# Altium project AD_info.PrjPcb (part 1 of 2)
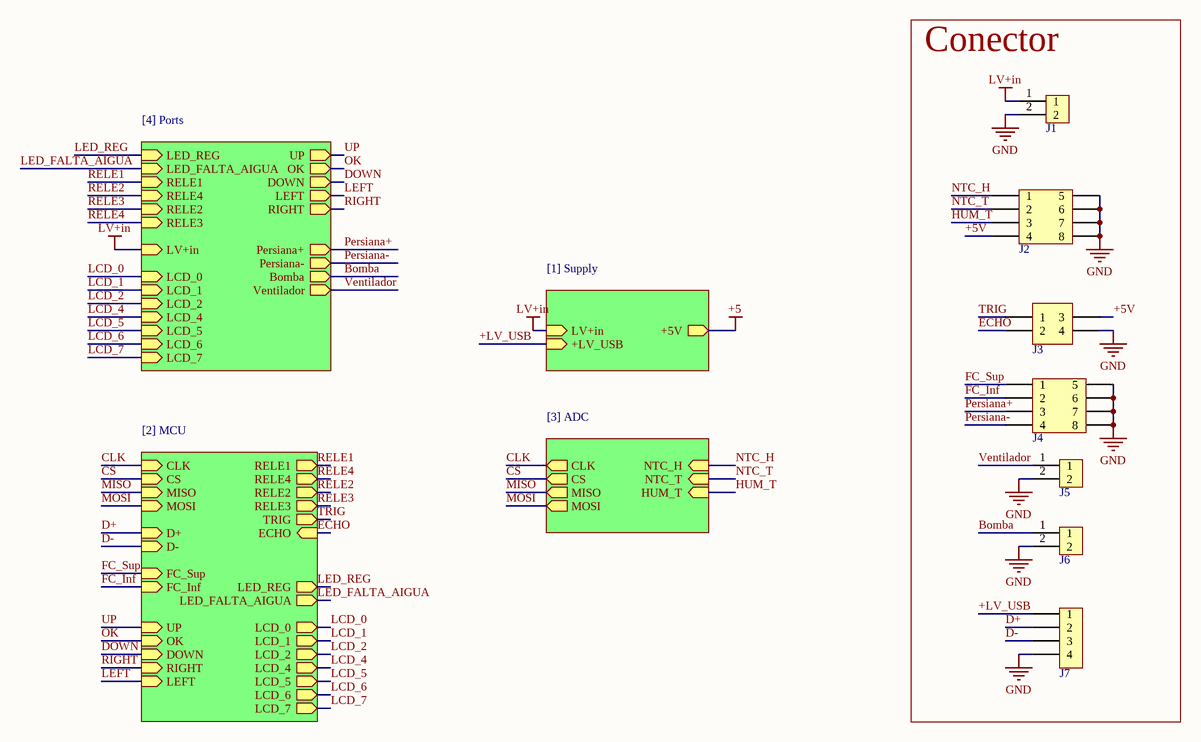
[diagram p0: AD_info.SchDoc]
AUTHORS: Bernat Canota, Yosra Azzouz, Carmen Unió, Inass Himiche; Company: UPC EEBE; Project: AD
5 sheets, 76 parts. Net scope: hierarchical (ports join the sheet entries above them; power ports are global).
Board file: AD_info.PcbDoc
Sheets:
  AD_info.SchDoc
    [1] Supply = [1] Supply.SchDoc
    [2] MCU = [2] MCU.SchDoc
    [3] ADC = [3] ADC.SchDoc
    [4] Ports = [4] Ports.SchDoc

## Sheet AD_info.SchDoc
size A4; DocumentNumber: 1; SheetNumber: 1; SheetTotal: 4

### Parts
J1  436500215  [J_MicroFit_2x1]  (value not drawn)
J2  105314-1108  [J_NanoFit_2X4]  (value not drawn)
J3  J_NanoFit_2x2  [J_NanoFit_2x2_v]  (value not drawn)
J4  105314-1108  [J_NanoFit_2X4]  (value not drawn)
J5  436500215  [J_MicroFit_2x1]  (value not drawn)
J6  436500215  [J_MicroFit_2x1]  (value not drawn)
J7  61300411121  [J_PinHeader_1x4]  (value not drawn)

### Blocks framed on the sheet
Conector: J1-J7

### Sub-sheets
[1] Supply = [1] Supply: LV+in (in), +5V (out), +LV_USB (in)
[2] MCU = [2] MCU: CLK (in), CS (in), MISO (in), MOSI (in), D+ (in), D- (in), TRIG (out), ECHO (in), FC_Sup (in), FC_Inf (in), RELE1 (out), RELE4 (out), RELE2 (out), RELE3 (out), UP (in), OK (in), DOWN (in), LEFT (in), RIGHT (in), LED_REG (out), LED_FALTA_AIGUA (out), LCD_0 (out), LCD_1 (out), LCD_2 (out), LCD_4 (out), LCD_5 (out), LCD_6 (out), LCD_7 (out)
[3] ADC = [3] ADC: CLK (out), CS (out), MISO (out), MOSI (out), NTC_H (in), NTC_T (in), HUM_T (in)
[4] Ports = [4] Ports: UP (out), OK (out), DOWN (out), LEFT (out), RIGHT (out), LED_REG (in), LED_FALTA_AIGUA (in), RELE1 (in), RELE4 (in), RELE2 (in), RELE3 (in), Persiana+ (out), Bomba (out), Persiana- (out), Ventilador (out), LV+in (in), LCD_0 (in), LCD_1 (in), LCD_2 (in), LCD_4 (in), LCD_5 (in), LCD_6 (in), LCD_7 (in)

### Nets
GND: J1.2 J2.5 J2.6 J2.7 J2.8 J3.4 J4.5 J4.6 J4.7 J4.8 J5.2 J6.2 J7.4
LV+in: J1.1 ; sheet [1] Supply/LV+in, sheet [4] Ports/LV+in
+5V: J2.4 J3.3
+LV_USB: J7.1 ; sheet [1] Supply/+LV_USB
Bomba: J6.1 ; sheet [4] Ports/Bomba
CLK: sheet [2] MCU/CLK, sheet [3] ADC/CLK
CS: sheet [2] MCU/CS, sheet [3] ADC/CS
D+: J7.2 ; sheet [2] MCU/D+
D-: J7.3 ; sheet [2] MCU/D-
DOWN: sheet [2] MCU/DOWN, sheet [4] Ports/DOWN
ECHO: J3.2 ; sheet [2] MCU/ECHO
FC_Inf: J4.2 ; sheet [2] MCU/FC_Inf
FC_Sup: J4.1 ; sheet [2] MCU/FC_Sup
HUM_T: J2.3 ; sheet [3] ADC/HUM_T
LCD_0: sheet [2] MCU/LCD_0, sheet [4] Ports/LCD_0
LCD_1: sheet [2] MCU/LCD_1, sheet [4] Ports/LCD_1
LCD_2: sheet [2] MCU/LCD_2, sheet [4] Ports/LCD_2
LCD_4: sheet [2] MCU/LCD_4, sheet [4] Ports/LCD_4
LCD_5: sheet [2] MCU/LCD_5, sheet [4] Ports/LCD_5
LCD_6: sheet [2] MCU/LCD_6, sheet [4] Ports/LCD_6
LCD_7: sheet [2] MCU/LCD_7, sheet [4] Ports/LCD_7
LED_FALTA_AIGUA: sheet [2] MCU/LED_FALTA_AIGUA, sheet [4] Ports/LED_FALTA_AIGUA
LED_REG: sheet [2] MCU/LED_REG, sheet [4] Ports/LED_REG
LEFT: sheet [2] MCU/LEFT, sheet [4] Ports/LEFT
MISO: sheet [2] MCU/MISO, sheet [3] ADC/MISO
MOSI: sheet [2] MCU/MOSI, sheet [3] ADC/MOSI
NTC_H: J2.1 ; sheet [3] ADC/NTC_H
NTC_T: J2.2 ; sheet [3] ADC/NTC_T
OK: sheet [2] MCU/OK, sheet [4] Ports/OK
Persiana+: J4.3 ; sheet [4] Ports/Persiana+
Persiana-: J4.4 ; sheet [4] Ports/Persiana-
RELE1: sheet [2] MCU/RELE1, sheet [4] Ports/RELE1
RELE2: sheet [2] MCU/RELE2, sheet [4] Ports/RELE4
RELE3: sheet [2] MCU/RELE3, sheet [4] Ports/RELE2  [project net RELE2]
RELE4: sheet [2] MCU/RELE4, sheet [4] Ports/RELE3  [project net RELE3]
RIGHT: sheet [2] MCU/RIGHT, sheet [4] Ports/RIGHT
TRIG: J3.1 ; sheet [2] MCU/TRIG
UP: sheet [2] MCU/UP, sheet [4] Ports/UP
Ventilador: J5.1 ; sheet [4] Ports/Ventilador

### Library data of the parts
J1 J5 J6 = J_MicroFit_2x1: Header 1 Row Vertical Polarizing Peg 2 Pin SMT/Glow Wire Compatible Tin Plate; Manufacturer 1: Molex; Manufacturer Part Number 1: 43650-0215; Supplier 1: Arrow Electronics; RoHS: Yes; Category: Headers and Wire Housings; Stock 1: 11086; Pricing 1: 1=0,87800, 10=0,74400, 80=0,63070, 3264=0,47000, 6528=0,45100, 13056=0,41760 (USD); ComponentLink1URL: https://datasheet.ciiva.com/19462/884109-19462034.pdf?src-supplier=Jameco; ComponentLink1Description: https://datasheet.ciiva.com/19462/884109-19462034.pdf?src-supplier=Jameco; ComponentLink2URL: https://datasheet.ciiva.com/5157/0436500215-pcb-headers-148687-5157608.pdf?src-supplier=Mouser; ComponentLink2Description: https://datasheet.ciiva.com/5157/0436500215-pcb-headers-148687-5157608.pdf?src-supplier=Mouser; ComponentLink3URL: https://datasheet.ciiva.com/16085/0436500215-pcb-headers-16085668.pdf?src-supplier=Onlinecomponents.com; ComponentLink3Description: https://datasheet.ciiva.com/16085/0436500215-pcb-headers-16085668.pdf?src-supplier=Onlinecomponents.com; ComponentLink4URL: https://datasheet.ciiva.com/11748/0900766b80307ce2-11748388.pdf?src-supplier=RSComponents; ComponentLink4Description: https://datasheet.ciiva.com/11748/0900766b80307ce2-11748388.pdf?src-supplier=RSComponents; ComponentLink5URL: https://datasheet.ciiva.com/9432/0436500215-pcb-headers-9432850.pdf?src-supplier=Avnet; ComponentLink5Description: https://datasheet.ciiva.com/9432/0436500215-pcb-headers-9432850.pdf?src-supplier=Avnet; ComponentLink6URL: https://datasheet.ciiva.com/7920/1889390-7920892.pdf?src-supplier=Element14; ComponentLink6Description: https://datasheet.ciiva.com/7920/1889390-7920892.pdf?src-supplier=Element14; Supplier Part Number 1: 43650-0215
J2 J4 = J_NanoFit_2x4: Nano-Fit Right Angle Header Through Hole 2.50mm Pitch Dual Row 8 Circuits Tin (Sn) Plating Black; Manufacturer: Molex; Temperature rating: -40° to +105°C; Category type: PCB header; Maximum current: 7.5 A; Maximum voltage: 750 V AC; Connections: 2x4; Connector Type: Header,Male Pin; Number of Positions: 8; .Creator: DO; Category: Connector; ComponentLink1Description: Datasheet; ComponentLink1URL: https://www.molex.com/molex/products/part-detail/pcb_headers/1053141104; ComponentLink2Description: Where buy it; ComponentLink2URL: *; Manufacturer part number: 105314-1108; Supplier: *; RoHS: *; Application: Wire to board; Product name: Nano-Fit; Flammability: 94V-0; Orientation: Right Angle; Mount: Through hole; Supplier 1: Digi-Key; Stock 1: 11021; Pricing 1: 1=1,98000, 10=1,68600, 156=1,39308, 1092=1,09983, 4992=0,97518, 10140=0,95318 (USD); Contact Plating: Tin; Contact Material: Brass; Contact Shape: Square; Insulation Material: Polymer; Insulation Color: Black; Min Operating Temperature: -40°C; Max Operating Temperature: 105°C; Fastening Type: Latch; Packaging: Tray; Number of Rows: 2; Termination: Solder; RoHS Compliant: Yes; ComponentLink3URL: http://www.farnell.com/datasheets/2551096.pdf?src-supplier=Newark; ComponentLink3Description: http://www.farnell.com/datasheets/2551096.pdf?src-supplier=Newark; ComponentLink4URL: https://www.molex.com/pdm_docs/sd/1053141104_sd.pdf?src-supplier=Digi-Key; ComponentLink4Description: https://www.molex.com/pdm_docs/sd/1053141104_sd.pdf?src-supplier=Digi-Key; Supplier Part Number 1: WM16909-ND
J3 = J_NanoFit_2x2: Conn Nano-Fit Power HDR 4 POS 2.5mm Solder ST Through Hole 4 Terminal Single Port Tray; Manufacturer 1: Molex; Manufacturer Part Number 1: 1053101104; Supplier 1: Farnell; RoHS: Yes; Category: Uncategorized; Stock 1: 255; Pricing 1: 1=1,43000, 10=1,18000, 50=0,74900, 100=0,72900, 500=0,71400, 1000=0,70700 (EUR); ComponentLink1URL: https://www.molex.com/pdm_docs/ps/PS-105300-100-001.pdf?src-supplier=Digi-Key; ComponentLink1Description: https://www.molex.com/pdm_docs/ps/PS-105300-100-001.pdf?src-supplier=Digi-Key; Supplier Part Number 1: 2820681
J7 = J_UART: CONN HEADER 4 POS 2.54; Manufacturer 1: Wurth Electronics; Number of Positions: 4; Gender: Male; Connector Type: Male Pin; Pitch: 0.1inch; .Creator: AC; Supplier 1: RSComponents; Manufacturer Part Number 1: 61300411121; RoHS: Yes; Category: Headers and Wire Housings; Stock 1: 1; Pricing 1: 5=0,19500, 250=0,08000, 500=0,07700, 2500=0,07500, 5000=0,07200 (USD); Mount: Through Hole; Contact Plating: Gold; Contact Material: Copper; Color: Black; Number of Rows: 1; Packaging: Bulk; Termination: Solder; Number of Contacts: 4; Contact Mating Length: 0.236inch; REACH SVHC: Unknown; Lead Free: Lead Free; RoHS Compliant: Yes; ComponentLink1URL: http://www.farnell.com/cad/1737268.pdf?src-supplier=Element14; ComponentLink1Description: http://www.farnell.com/cad/1737268.pdf?src-supplier=Element14; ComponentLink2URL: https://katalog.we-online.de/em/datasheet/6130xx11121.pdf?src-supplier=Digi-Key; ComponentLink2Description: https://katalog.we-online.de/em/datasheet/6130xx11121.pdf?src-supplier=Digi-Key; Supplier Part Number 1: 8281594

## Sheet [1] Supply.SchDoc
size A4; DocumentNumber: 2; SheetNumber: 2; SheetTotal: 4
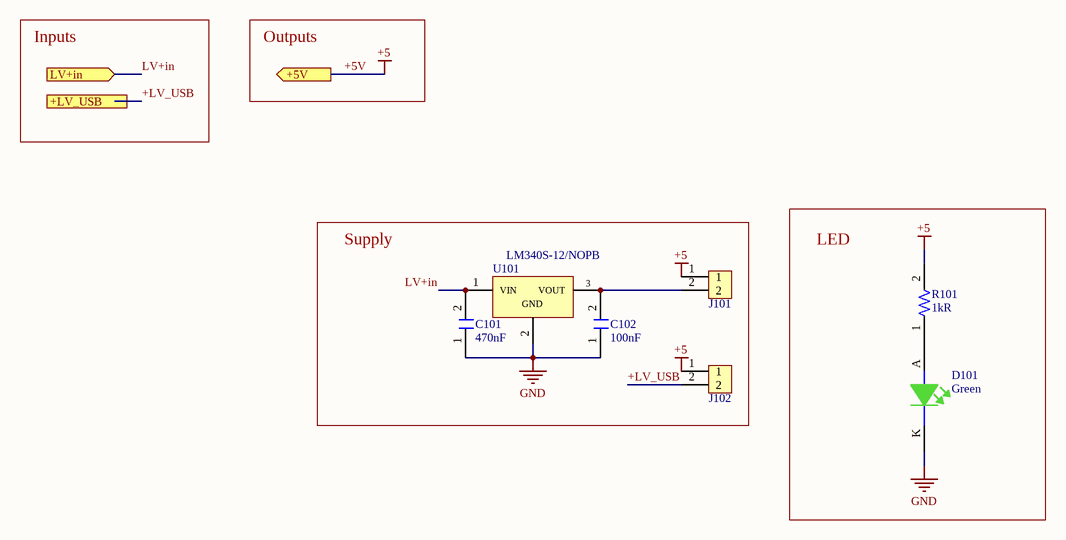
[diagram p1: [1] Supply.SchDoc]

### Parts
C101  Capacitance: 470nF  [C1206FNPC-RW]  (hidden comment: 885012208011)
C102  Capacitance: 100nF  [C1206FNPC-RW]  (hidden comment: 885012208058)
D101  Color: Green  [LED_1206_WE]  (hidden comment: 150120GS75000)
J101  61300211121  [J_Pinheader_1x2]  (value not drawn)
J102  61300211121  [J_Pinheader_1x2]  (value not drawn)
R101  Resistance: 1kR  [R1206FTK-W]  (hidden comment: ERJT08J102V)
U101  Manufacturer Part Number: LM340S-12/NOPB  [LDO_35V-1/12V-TO220]  (hidden comment: DO_35V-1/12V-TO220)

### Blocks framed on the sheet
Supply: C101 C102 J101 J102 U101
LED: D101 R101

### Ports
+5V (out, see AD_info[3B]), +LV_USB (in, see AD_info[3B]), LV+in (in, see AD_info[3B])

### Nets
+5V: J101.1 J102.1 R101.2 ; port +5V  [also labelled +5]
GND: C101.1 C102.1 D101.K U101.2(GND)
LV+in: C101.2 U101.1(VIN) ; port LV+in
+LV_USB: J102.2 ; port +LV_USB
NetC102_2: C102.2 J101.2 U101.3(VOUT)
NetD101_A: D101.A R101.1

### Notes on the sheet
- Inputs
- Outputs

### Library data of the parts
C101 = C470n-10V-1206FNPC-X7R: Cap, 0.47ΜF, 10V, 10%, X7R, 1206; Manufacturer 1: Wurth Electronics; .Creator: DO; Supplier 1: Digi-Key; Manufacturer Part Number 1: 885012208011; RoHS: Yes; Category: Ceramic Capacitors; Stock 1: 1142; Pricing 1: 1=0,20000, 10=0,17700, 100=0,15900, 500=0,14000 (USD); Mount: Surface Mount; Case/Package: 1206; Case Code (Metric): 3216; Case Code (Imperial): 1206; Min Operating Temperature: -55°C; Max Operating Temperature: 125°C; Packaging: Tape and Reel; Voltage Rating: 10V; Tolerance: 10%; Length: 0.126inch; Width: 0.063inch; Thickness: 0.051inch; RoHS Compliant: Yes; ComponentLink1URL: http://www.farnell.com/datasheets/2546926.pdf?src-supplier=Farnell; ComponentLink1Description: http://www.farnell.com/datasheets/2546926.pdf?src-supplier=Farnell; ComponentLink2URL: https://katalog.we-online.de/pbs/datasheet/885012208011.pdf?src-supplier=Digi-Key; ComponentLink2Description: https://katalog.we-online.de/pbs/datasheet/885012208011.pdf?src-supplier=Digi-Key; Supplier Part Number 1: 732-7683-1-ND; ComponentLink3Description: Wurth Elektronik; ComponentLink3URL: https://www.we-online.com/catalog/en/WCAP-CSGP-10VDC?sq=885012208011#885012208011
C102 = C100n-25V-1206FNPC-X7R: Cap Cer 0.1UF 25V X7R 1206; Manufacturer: Wurth Electronics; Tolerance: 10%; .Creator: DO; Category: Capacitor; ComponentLink1Description: Datasheet; ComponentLink1URL: https://www.we-online.com/catalog/datasheet/885012208058.pdf; ComponentLink2Description: Where buy it; ComponentLink2URL: https://www.we-online.com/catalog/en/WCAP-CSGP-25VDC#885012208058; Supplier 1: Digi-Key; Manufacturer Part Number: 885012208058; RoHS: Yes; Stock 1: 4375; Pricing 1: 1=0,11000, 10=0,10100, 100=0,09100, 500=0,08000 (USD); Mount: Surface Mount; Case/Package: 1206; Case Code (Metric): 3216; Case Code (Imperial): 1206; Min Operating Temperature: -55°C; Max Operating Temperature: 125°C; Packaging: Tape and Reel; Voltage Rating: 25V; Length: 0.126inch; Width: 0.063inch; Thickness: 0.035inch; RoHS Compliant: Yes; ComponentLink3URL: https://katalog.we-online.de/pbs/datasheet/885012208058.pdf?src-supplier=Digi-Key; ComponentLink3Description: https://katalog.we-online.de/pbs/datasheet/885012208058.pdf?src-supplier=Digi-Key; Supplier Part Number 1: 732-8109-1-ND
D101 = LEDGS-1206-450: Led, Green, 520 Nm, 3.2 V, 30 Ma, 450 Mcd Rohs Compliant: Yes; Manufacturer: Wurth Electronics; Wavelength: 520nm; Luminous Intensity: 450mcd; Viewing Angle: 140°; Forward Current: 30mA; Lens Style: Clear,Rectangular; Test Current: 20mA; Forward Voltage: 3.2V; .Creator: GP; Supplier 1: RSComponents; RoHS: Yes; Category: LEDs; Stock 1: 1; Pricing 1: 50=0,23200, 500=0,16400, 750=0,15500, 1500=0,15000, 3000=0,14200 (USD); Mount: Surface Mount; Case/Package: 1206; Case Code (Metric): 3216; Case Code (Imperial): 1206; Min Operating Temperature: -40°C; Max Operating Temperature: 85°C; Package Quantity: 3000; Packaging: Tape and Reel; Dominant Wavelength: 520nm; Length: 3.2mm; Width: 1.6mm; Height: 0.68mm; REACH SVHC: Unknown; RoHS Compliant: Yes; ComponentLink1URL: https://datasheet.ciiva.com/22656/150120gs75000-22656979.pdf?src-supplier=Element14; ComponentLink1Description: https://datasheet.ciiva.com/22656/150120gs75000-22656979.pdf?src-supplier=Element14; ComponentLink2URL: https://datasheet.ciiva.com/29279/759441-da-01-en-chipled-1206-w-kl-gruen-150120gs75000-29279042.pdf?src-supplier=Conrad; ComponentLink2Description: https://datasheet.ciiva.com/29279/759441-da-01-en-chipled-1206-w-kl-gruen-150120gs75000-29279042.pdf?src-supplier=Conrad; ComponentLink3URL: https://datasheet.ciiva.com/48430/150120gs75000-eng-tds-48430053.pdf?src-supplier=Distrelec; ComponentLink3Description: https://datasheet.ciiva.com/48430/150120gs75000-eng-tds-48430053.pdf?src-supplier=Distrelec; ComponentLink4URL: https://datasheet.ciiva.com/29561/150120gs75000-29561883.pdf?src-supplier=Digi-Key; ComponentLink4Description: https://datasheet.ciiva.com/29561/150120gs75000-29561883.pdf?src-supplier=Digi-Key; ComponentLink5URL: https://datasheet.ciiva.com/29561/150120gs75000-29561884.pdf?src-supplier=Digi-Key; ComponentLink5Description: https://datasheet.ciiva.com/29561/150120gs75000-29561884.pdf?src-supplier=Digi-Key; ComponentLink6URL: https://datasheet.ciiva.com/29561/150120gs75000-29561885.pdf?src-supplier=Digi-Key; ComponentLink6Description: https://datasheet.ciiva.com/29561/150120gs75000-29561885.pdf?src-supplier=Digi-Key; Supplier Part Number 1: 8154247P; Manufacturer Part Number: 150120GS75000; ComponentLink7Description: Where buy it; ComponentLink7URL: https://www.we-online.com/catalog/en/WL-SMCW?sq=150120GS75000#150120GS75000
J101 J102 = J_Jumper: CONN HEADER 2 POS 2.54; Manufacturer: Molex; Temperature rating: -40° to +105°C; Category type: PCB-PCB; Product name: Pin Header; Maximum current: 3 A; Maximum voltage: 250 V AC; Connections: 1x2; Current Rating: 3A; Voltage Rating: 250V; Number of Positions: 2; Gender: Male; Connector Type: Male Pin; Pitch: 0.1inch; .Creator: GP; Category: Connector; ComponentLink1Description: Datasheet; ComponentLink1URL: https://www.we-online.com/catalog/datasheet/61300211121.pdf; ComponentLink2Description: Where buy it; ComponentLink2URL: https://www.we-online.com/catalog/en/PHD_2_54_THT_PIN_HEADER_6130XX11121?sq=61300211121&sp=https%3A%2F%2Fwww.we-online.com%2Fweb%2Fen%2Fwuerth_elektronik%2Fsearchpage.php%3Fsearch%3D61300211121#61300211121; Manufacturer part number: 61300211121; Supplier: Würth Elektronik; RoHS: *; Application: Shortcircuit; Flammability: 94V-0; Orientation: Vertical; Mount: Through hole; Supplier 1: RSComponents; Stock 1: 1855; Pricing 1: 5=0,14100, 50=0,09700, 100=0,07800, 200=0,07300, 500=0,06800 (USD); Contact Plating: Gold; Housing Material: PBT; Contact Material: Copper Alloy,Copper; Color: Black; Min Operating Temperature: -40°C; Max Operating Temperature: 125°C; Number of Rows: 1; Contact Gender: Male; Packaging: Bulk; Termination: Through Hole; Number of Contacts: 2; Contact Mating Length: 0.236inch; REACH SVHC: Unknown; Lead Free: Lead Free; ComponentLink3URL: https://datasheet.ciiva.com/13619/6130xx11121-48870-13619345.pdf?src-supplier=Mouser; ComponentLink3Description: https://datasheet.ciiva.com/13619/6130xx11121-48870-13619345.pdf?src-supplier=Mouser; Supplier Part Number 1: 8281581
R101 = R1k-1206FTK: Res Thick Film 1206 1K Ohm 5% 0.33W(1/3W) ±200ppm/C Pad SMD Automotive T/R; Manufacturer: Panasonic; Temperature Coefficient: 200ppm/°C; Power Rating: 330mW; Voltage Rating: 200V; Max Power Dissipation: 333mW; .Creator: GP; Category: Resistor; ComponentLink1Description: Datasheet; ComponentLink1URL: https://docs.rs-online.com/ef78/0900766b812cb812.pdf; ComponentLink2Description: Where buy it; ComponentLink2URL: https://es.rs-online.com/web/p/resistencias-de-montaje-en-superficie/7218936; Supplier 1: RSComponents; Manufacturer Part Number: ERJT08J102V; RoHS: Yes; Stock 1: 1; Pricing 1: 5=0,32200, 50=0,30000, 100=0,28100, 250=0,25900, 500=0,23800 (USD); Mount: Surface Mount; Case/Package: 1206; Number of Pins: 2; Contact Plating: Tin; Case Code (Metric): 3216; Case Code (Imperial): 1206; Min Operating Temperature: -55°C; Max Operating Temperature: 155°C; Tolerance: 5%; Resistor Type: Thick Film; Package Quantity: 5000; Packaging: Tape and Reel; Number of Terminations: 2; Voltage Rating (DC): 200V; Termination: Tab; Features: Automotive AEC-Q200; Length: 3.2mm; Width: 0.063inch; Height: 0.6mm; Depth: 1.6mm; Radiation Hardening: No; REACH SVHC: No SVHC; Military Standard: Not; RoHS Compliant: Yes; Supplier Part Number 1: 7218936
U101 = CMP-00147-1: 1.5-A, 35-V, linear voltage regulator 3-TO-220 -40 to 125; Manufacturer: Texas Instruments; Output Voltage: 12V; Quiescent Current: 8mA; Output Type: Fixed; Dropout Voltage: 2V; Accuracy: 2%; Output Current: 1A; .Creator: AC; Number of Outputs: 1; Polarity: Positive; Max Input Voltage: 35V; Mount: Through Hole; Package Quantity: 45; Width: 4.7mm; RoHS: Yes; ComponentLink1URL: https://datasheet.ciiva.com/16490/lm340-n-16490133.pdf?src-supplier=Avnet+Asia; Min Operating Temperature: -40°C; Number of Pins: 3; RoHS Compliant: Yes; ComponentLink2URL: https://es.rs-online.com/web/p/reguladores-de-tension/1977323; Max Operating Temperature: 125°C; Design Item ID: LDO_35V-1/12V-TO220; Source: Semiconductor.SchLib; ComponentLink2Description: Where buy it; Length: 10.16mm; Category: Voltage Regulators - Linear; Pricing 1: 1=1,97000, 10=1,76700, 25=1,66680, 100=1,42020, 250=1,33348, 500=1,16680, 1000=1,10075 (USD); Lead Free: Lead Free; ComponentLink1Description: https://datasheet.ciiva.com/16490/lm340-n-16490133.pdf?src-supplier=Avnet+Asia; Height: 8.89mm; Packaging: Rail/Tube; Radiation Hardening: No; Series: LM340-N; Max Output Current: 1A; Voltage: 12V; Case/Package: TO-220; Output Voltage Accuracy: 2%

## Sheet [2] MCU.SchDoc
size A4; DocumentNumber: 3; SheetNumber: 3; SheetTotal: 4
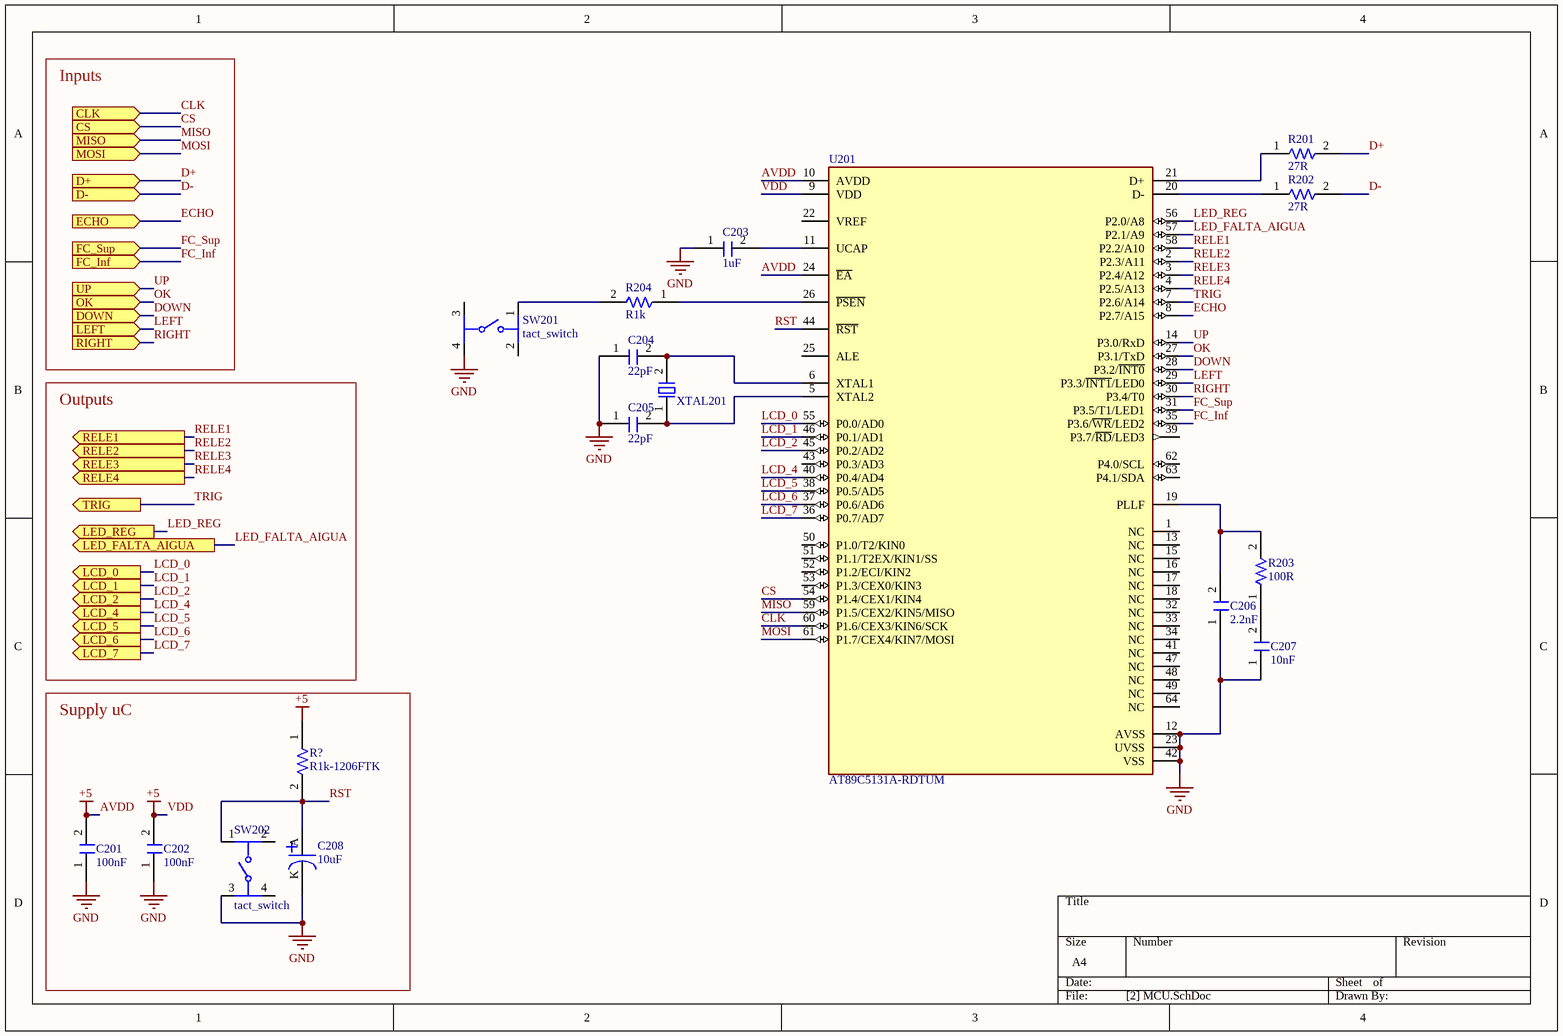
[diagram p2: [2] MCU.SchDoc]

### Parts
C201  Capacitance: 100nF  [C1206FNPC-RW]  (hidden comment: 885012208058)
C202  Capacitance: 100nF  [C1206FNPC-RW]  (hidden comment: 885012208058)
C203  Capacitance: 1uF  [C1206FNPC-RW]  (hidden comment: 885012208013)
C204  Capacitance: 22pF  [C0805FNPC-W]  (hidden comment: 885012208058)
C205  Capacitance: 22pF  [C0805FNPC-W]  (hidden comment: 885012208058)
C206  Capacitance: 2.2nF  [C2.2u-100V-1812MLCC-X7R]  (hidden comment: HMK432B7225KM-T)
C207  Capacitance: 10nF  [C0805FNPC-R]  (hidden comment: 885012207092)
C208  10uF  [C100u-100V-0.9A]
R201  Resistance: 27R  [R1206FTK-W]  (hidden comment: RCC1206470RFKEA)
R202  Resistance: 27R  [R1206FTK-W]  (hidden comment: RCC1206470RFKEA)
R203  Resistance: 100R  [R1206FTK-W]  (hidden comment: CRG1206F100R)
R204  R1k  [R1206FTK-W]
R?  R1k-1206FTK  [R1206FTK-W]
SW201  tact_switch  [FP-PTS647SK38SMTR2LFS-MFG]
SW202  tact_switch  [FP-PTS647SK38SMTR2LFS-MFG]
U201  AT89C5131A-RDTUM  [FP-AT89C5131A-RDTUM-IPC_C]
XTAL201  XTAL20M_SMD  [XTAL20M_SMD]  (value not drawn)

### Blocks framed on the sheet
Supply uC: C201 C202 C208 R? SW202

### Ports
CLK (in, see AD_info[2B], [3] ADC[1A]), CS (in, see AD_info[2B], [3] ADC[1A]), D+ (in, see AD_info[2B]), D- (in, see AD_info[2B]), DOWN (in, see AD_info[2C], [4] Ports[1B]), ECHO (in, see AD_info[2B]), FC_Inf (in, see AD_info[2B]), FC_Sup (in, see AD_info[2B]), LCD_0 (out, see AD_info[2B], [4] Ports[1A]), LCD_1 (out, see AD_info[2C], [4] Ports[1A]), LCD_2 (out, see AD_info[2C], [4] Ports[1B]), LCD_4 (out, see AD_info[2C], [4] Ports[1B]), LCD_5 (out, see AD_info[2C], [4] Ports[1B]), LCD_6 (out, see AD_info[2C], [4] Ports[1B]), LCD_7 (out, see AD_info[2C], [4] Ports[1B]), LED_FALTA_AIGUA (out, see AD_info[2B], [4] Ports[1A]), LED_REG (out, see AD_info[2B], [4] Ports[1A]), LEFT (in, see AD_info[2C], [4] Ports[1B]), MISO (in, see AD_info[2B], [3] ADC[1A]), MOSI (in, see AD_info[2B], [3] ADC[1B]), OK (in, see AD_info[2C], [4] Ports[1B]), RELE1 (out, see AD_info[2B], [4] Ports[1A]), RELE2 (out, see AD_info[2B]), RELE3 (out, see AD_info[2B]), RELE4 (out, see AD_info[2B]), RIGHT (in, see AD_info[2C], [4] Ports[1B]), TRIG (out, see AD_info[2B]), UP (in, see AD_info[2B], [4] Ports[1B])

### Nets
+5: C201.2 C202.2 R?.1 U201.9(VDD) U201.10(AVDD) U201.24(~{EA})  [also labelled AVDD, VDD]  [project net +5V]
GND: C201.1 C202.1 C203.1 C204.1 C205.1 C206.1 C207.1 C208.K(-) SW201.4 SW202.3 U201.12(AVSS) U201.23(UVSS) U201.42(VSS)
CLK: U201.60(P1.6/CEX3/KIN6/SCK) ; port CLK
CS: U201.54(P1.4/CEX1/KIN4) ; port CS
D+: R201.2 ; port D+
D-: R202.2 ; port D-
DOWN: U201.28(P3.2/~{INT0}) ; port DOWN
ECHO: U201.8(P2.7/A15) ; port ECHO
FC_Inf: U201.35(P3.6/~{WR}/LED2) ; port FC_Inf
FC_Sup: U201.31(P3.5/T1/LED1) ; port FC_Sup
LCD_0: U201.55(P0.0/AD0) ; port LCD_0
LCD_1: U201.46(P0.1/AD1) ; port LCD_1
LCD_2: U201.45(P0.2/AD2) ; port LCD_2
LCD_4: U201.40(P0.4/AD4) ; port LCD_4
LCD_5: U201.38(P0.5/AD5) ; port LCD_5
LCD_6: U201.37(P0.6/AD6) ; port LCD_6
LCD_7: U201.36(P0.7/AD7) ; port LCD_7
LED_FALTA_AIGUA: U201.57(P2.1/A9) ; port LED_FALTA_AIGUA
LED_REG: U201.56(P2.0/A8) ; port LED_REG
LEFT: U201.29(P3.3/~{INT1}/LED0) ; port LEFT
MISO: U201.59(P1.5/CEX2/KIN5/MISO) ; port MISO
MOSI: U201.61(P1.7/CEX4/KIN7/MOSI) ; port MOSI
OK: U201.27(P3.1/TxD) ; port OK
RELE1: U201.58(P2.2/A10) ; port RELE1
RELE2: U201.2(P2.3/A11) ; port RELE2
RELE3: U201.3(P2.4/A12) ; port RELE3  [project net RELE2]
RELE4: U201.4(P2.5/A13) ; port RELE4  [project net RELE3]
RIGHT: U201.30(P3.4/T0) ; port RIGHT
RST: C208.A(+) R?.2 SW202.1 U201.44(~{RST})
TRIG: U201.7(P2.6/A14) ; port TRIG
UP: U201.14(P3.0/RxD) ; port UP
NetC203_2: C203.2 U201.11(UCAP)
NetC204_2: C204.2 U201.6(XTAL1) XTAL201.2
NetC205_2: C205.2 U201.5(XTAL2) XTAL201.1
NetC206_2: C206.2 R203.2 U201.19(PLLF)
NetC207_2: C207.2 R203.1
NetR201_1: R201.1 U201.21(D+)
NetR202_1: R202.1 U201.20(D-)
NetR204_1: R204.1 U201.26(~{PSEN})
NetR204_2: R204.2 SW201.1

Not connected (* = marked no-connect by the designer): SW201 2 3; SW202 2 4; U201 1(NC) 13(NC) 15(NC) 16(NC) 17(NC) 18(NC) 22(VREF) 25(ALE) 32(NC) 33(NC) 34(NC) 39(P3.7/~{RD}/LED3) 41(NC) 43(P0.3/AD3) 47(NC) 48(NC) 49(NC) 50(P1.0/T2/KIN0) 51(P1.1/T2EX/KIN1/SS) 52(P1.2/ECI/KIN2) 53(P1.3/CEX0/KIN3) 62(P4.0/SCL) 63(P4.1/SDA) 64(NC)

### Notes on the sheet
- Inputs
- Outputs

### Library data of the parts
C201 C202 = C100n-25V-1206FNPC-X7R: as C102 on sheet [1] Supply; Category: Capacitor; ComponentLink1Description: Datasheet; ComponentLink1URL: https://www.we-online.com/catalog/datasheet/885012208058.pdf; ComponentLink2Description: Where buy it; ComponentLink2URL: https://www.we-online.com/catalog/en/WCAP-CSGP-25VDC#885012208058; Supplier 1: Digi-Key; Manufacturer Part Number: 885012208058; RoHS: Yes; Stock 1: 4375; Pricing 1: 1=0,11000, 10=0,10100, 100=0,09100, 500=0,08000 (USD); Mount: Surface Mount; Case/Package: 1206; Case Code (Metric): 3216; Case Code (Imperial): 1206; Min Operating Temperature: -55°C; Max Operating Temperature: 125°C; Packaging: Tape and Reel; Voltage Rating: 25V; Length: 0.126inch; Width: 0.063inch; Thickness: 0.035inch; RoHS Compliant: Yes; ComponentLink3URL: https://katalog.we-online.de/pbs/datasheet/885012208058.pdf?src-supplier=Digi-Key; ComponentLink3Description: https://katalog.we-online.de/pbs/datasheet/885012208058.pdf?src-supplier=Digi-Key; Supplier Part Number 1: 732-8109-1-ND
C203 = C1u-10V-1206FNPC-X7R: Cap, Mlcc, X7R, 1Uf, 10V, 1206 Rohs Compliant: Yes; Manufacturer 1: Wurth Electronics; Tolerance: 10%; .Creator: GP; Supplier 1: Digi-Key; Manufacturer Part Number 1: 885012208013; RoHS: Yes; Category: Ceramic Capacitors; Stock 1: 2734; Pricing 1: 1=0,16000, 10=0,14900, 100=0,13300, 500=0,11800 (USD); Mount: Surface Mount; Case/Package: 1206; Case Code (Metric): 3216; Case Code (Imperial): 1206; Min Operating Temperature: -55°C; Max Operating Temperature: 125°C; Packaging: Tape and Reel; Voltage Rating: 10V; Length: 0.126inch; Width: 0.063inch; Thickness: 0.051inch; RoHS Compliant: Yes; ComponentLink1URL: https://katalog.we-online.de/pbs/datasheet/885012208013.pdf?src-supplier=Digi-Key; ComponentLink1Description: https://katalog.we-online.de/pbs/datasheet/885012208013.pdf?src-supplier=Digi-Key; Supplier Part Number 1: 732-7685-1-ND; ComponentLink2Description: Wurth Elektronik; ComponentLink2URL: https://www.we-online.com/catalog/en/WCAP-CSGP-10VDC?sq=885012208013#885012208013
C204 C205 = C0.22u-0805FNPC-X5R: Cap Ceramic 0.22uF 50V X5R 10% Pad SMD 0805 85C Low ESR Automotive T/R; Manufacturer: Taiyo Yuden; Manufacturer Part Number: UMK212BJ224KGHT; .Creator: DR; Category: Capacitor; ComponentLink1Description: Datasheet; ComponentLink1URL: https://eu.mouser.com/datasheet/2/396/taiyo_yuden_12132018_mlcc11_hq_e-1510082.pdf; ComponentLink2Description: Where buy it; ComponentLink2URL: https://eu.mouser.com/ProductDetail/Taiyo-Yuden/UMK212BJ224KGHT?qs=CNQs48zzdnpf%2FbZJTfp33Q%3D%3D; Supplier 1: Digi-Key; RoHS: Yes; Stock 1: 900; Pricing 1: 1=0,20000, 10=0,13700, 50=0,08220, 100=0,06950, 500=0,04754, 1000=0,04206 (USD); Mount: Surface Mount; Case/Package: 0805; Case Code (Metric): 2012; Case Code (Imperial): 0805; Min Operating Temperature: -55°C; Max Operating Temperature: 85°C; Package Quantity: 3000; Packaging: Tape and Reel; Tolerance: 10%; Voltage Rating: 50V; Voltage Rating (DC): 50V; Dielectric: X5R; Termination: SMD/SMT; Length: 0.079inch; Width: 0.049inch; Height: 1.25mm; Thickness: 0.053inch; Ratings: AEC-Q200; Lead Free: Lead Free; Halogen Free: Halogen Free; RoHS Compliant: Yes; Supplier Part Number 1: 587-3514-1-ND
C206 = C2.2u-100V-1812MLCC-X7R: 贴片陶瓷电容 2.2uF ±10% 100V X7R 1812; Manufacturer: Taiyo Yuden; .Creator: DO; Manufacturer Part Number: HMK432B7225KM-T; RoHS: Yes; Category: Ceramic Capacitors; Stock 1: 13000; Pricing 1: 500=0,58000, 1000=0,47500, 1500=0,47000, 2000=0,46500 (USD); Mount: Surface Mount; Case/Package: 1812; Number of Pins: 2; Case Code (Metric): 4532; Case Code (Imperial): 1812; Min Operating Temperature: -55°C; Max Operating Temperature: 125°C; Package Quantity: 1; Voltage Rating: 100V; Tolerance: 10%; Packaging: Tape and Reel; Voltage Rating (DC): 100V; Dielectric: X7R; Termination: SMD/SMT; Series: M; Construction: Flat; Resistor Type: Ceramic; Length: 4.5mm; Width: 0.126inch; Height: 2.5mm; Thickness: 0.106inch; Depth: 3.2mm; Radiation Hardening: No; RoHS Compliant: Yes; REACH SVHC: Unknown; Halogen Free: Halogen Free; ComponentLink1URL: https://datasheet.ciiva.com/142/hmk432b7225km-t-ss-142288.pdf?src-supplier=Digi-Key; ComponentLink1Description: https://datasheet.ciiva.com/142/hmk432b7225km-t-ss-142288.pdf?src-supplier=Digi-Key; ComponentLink2URL: https://datasheet.ciiva.com/26871/getdatasheetpartid-638888-26871989.pdf?src-supplier=Verical; ComponentLink2Description: https://datasheet.ciiva.com/26871/getdatasheetpartid-638888-26871989.pdf?src-supplier=Verical; ComponentLink3URL: https://datasheet.ciiva.com/30247/946hmk432b7225km-t-30247370.pdf?src-supplier=Onlinecomponents.com; ComponentLink3Description: https://datasheet.ciiva.com/30247/946hmk432b7225km-t-30247370.pdf?src-supplier=Onlinecomponents.com; ComponentLink4URL: https://datasheet.ciiva.com/28645/746258-28645086.pdf?src-supplier=Element14; ComponentLink4Description: https://datasheet.ciiva.com/28645/746258-28645086.pdf?src-supplier=Element14; ComponentLink5URL: https://datasheet.ciiva.com/15921/mlcc06-e-15921031.pdf?src-supplier=Onlinecomponents.com; ComponentLink5Description: https://datasheet.ciiva.com/15921/mlcc06-e-15921031.pdf?src-supplier=Onlinecomponents.com; Supplier Part Number 1: 9062137; Supplier 1: Future Electronics
C207 = C10n-50V-0805FNPC-X7R: Cap, 0.01ΜF, 50V, 10%, X7R, 0805; Manufacturer 1: Wurth Electronics; .Creator: DR; Supplier 1: RSComponents; Manufacturer Part Number 1: 885012207092; RoHS: Yes; Category: Ceramic Capacitors; Stock 1: 1; Pricing 1: 4000=0,03200, 12000=0,03100 (USD); Mount: Surface Mount; Case/Package: 0805; Case Code (Metric): 2012; Case Code (Imperial): 0805; Min Operating Temperature: -55°C; Max Operating Temperature: 125°C; Packaging: Cut Tape; Voltage Rating: 50V; Dielectric: X7R; Tolerance: 10%; Voltage Rating (DC): 50V; Length: 0.079inch; Width: 0.049inch; Thickness: 0.035inch; REACH SVHC: Unknown; RoHS Compliant: Yes; ComponentLink1URL: http://www.farnell.com/datasheets/1958497.pdf?src-supplier=Farnell; ComponentLink1Description: http://www.farnell.com/datasheets/1958497.pdf?src-supplier=Farnell; ComponentLink2URL: http://www.farnell.com/datasheets/1958497.pdf?src-supplier=Element14; ComponentLink2Description: http://www.farnell.com/datasheets/1958497.pdf?src-supplier=Element14; ComponentLink3URL: http://www.farnell.com/datasheets/1958497.pdf?src-supplier=Newark; ComponentLink3Description: http://www.farnell.com/datasheets/1958497.pdf?src-supplier=Newark; ComponentLink4URL: https://katalog.we-online.de/pbs/datasheet/885012207092.pdf?src-supplier=Digi-Key; ComponentLink4Description: https://katalog.we-online.de/pbs/datasheet/885012207092.pdf?src-supplier=Digi-Key; Supplier Part Number 1: 1813941
C208 = CMP-00044-1: Cap 100 Uf 20% 100 V; Manufacturer: Wurth Electronics; Manufacturer Part Number: 860130878011; Voltage Rating: 100V; Value: 100µF; Ripple Current: 270mA; Polarity: Polar; .Creator: GP; Life (Hours): 2000Hour; Lead Pitch: 0.197inch; Package Quantity: 300; Tolerance: 20%; Case/Package: Radial; Source: Passives.SchLib; ComponentLink1Description: http://katalog.we-online.de/pbs/datasheet/860130878011.pdf?src-supplier=Digi-Key; Max Operating Temperature: 125°C; Min Operating Temperature: -40°C; Pricing 1: 2=1,84300, 20=1,71500, 50=1,54700, 100=1,43900, 200=1,27100 (USD); Mount: Through Hole; Stock 1: 1; Packaging: Tape and Reel; ComponentLink1URL: http://katalog.we-online.de/pbs/datasheet/860130878011.pdf?src-supplier=Digi-Key; RoHS: Yes; Design Item ID: C100u-100V-0.9A; Height - Seated (Max): 1.043inch; RoHS Compliant: Yes; Category: Aluminum Electrolytic Capacitors
R201 R202 = R470-1206FTK: Res Thick Film 1206 470 Ohm 1% 1/2W ±100ppm/°C Molded SMD; Manufacturer: Vishay Dale; .Creator: AC; Supplier 1: Newark; RoHS: Yes; Stock 1: 3700; Pricing 1: 10=0,22000, 25=0,17500, 50=0,13000, 100=0,08600, 250=0,06900, 500=0,05200, 1000=0,03500 (USD); Supplier Part Number 1: 45AJ7205; Manufacturer Part Number: RCC1206470RFKEA; ComponentLink1Description: Where buy it; ComponentLink1URL: https://www.mouser.es/ProductDetail/Vishay-Dale/RCC1206470RFKEA?qs=sGAEpiMZZMvdGkrng054twq3eZrCFN897p18zMH0sI9ArskKyJc2dg%3D%3D; ComponentLink2Description: Datasheet; ComponentLink2URL: https://www.mouser.es/datasheet/2/427/rcce3-2897337.pdf
R203 = R100-1206FTK: Res Thick Film 1206 100 Ohm 1% 0.25W(1/4W) ±200ppm/C Pad SMD T/R; Manufacturer: TE Connectivity; Temperature Coefficient: 200ppm/°C; Max Power Dissipation: 250mW; Voltage Rating: 200V; Number of Resistors: 1; .Creator: AC; Category: Resistor; ComponentLink1Description: Datasheet; ComponentLink1URL: https://docs.rs-online.com/7aab/0900766b815b7339.pdf; ComponentLink2Description: Where buy it; ComponentLink2URL: https://es.rs-online.com/web/p/resistencias-de-montaje-en-superficie/2232120; Supplier 1: Digi-Key; Manufacturer Part Number: CRG1206F100R; RoHS: Yes; Stock 1: 13476; Pricing 1: 1=0,10000, 10=0,07600, 100=0,02920, 1000=0,01285, 2500=0,01110 (USD); Mount: Surface Mount; Case/Package: 1206; Case Code (Imperial): 1206; Case Code (Metric): 3216; Weight: 0.000571oz; Min Operating Temperature: -55°C; Max Operating Temperature: 125°C; Tolerance: 1%; Resistor Type: Thick Film; Packaging: Tape and Reel; Package Quantity: 5000; Number of Terminations: 2; Series: CRG, Neohm; Power Rating: 250mW; Termination: Solder; Technology: THICK FILM; Length: 3.1mm; Width: 1.55mm; Height: 0.55mm; Depth: 1.55mm; Radiation Hardening: No; RoHS Compliant: Yes; ELV: Compliant; ComponentLink3URL: https://datasheet.ciiva.com/11808/0900766b800a696e-11808648.pdf?src-supplier=RSComponents; ComponentLink3Description: https://datasheet.ciiva.com/11808/0900766b800a696e-11808648.pdf?src-supplier=RSComponents; ComponentLink4URL: https://datasheet.ciiva.com/16763/70063020-16763547.pdf?src-supplier=Allied+Electronics; ComponentLink4Description: https://datasheet.ciiva.com/16763/70063020-16763547.pdf?src-supplier=Allied+Electronics; ComponentLink5URL: https://datasheet.ciiva.com/5562/eng-ds-1773204-g-5562604.pdf?src-supplier=Mouser; ComponentLink5Description: https://datasheet.ciiva.com/5562/eng-ds-1773204-g-5562604.pdf?src-supplier=Mouser; Supplier Part Number 1: A106068CT-ND
R204 R? = CMP-00077-3: Res Thick Film 1206 1K Ohm 5% 0.33W(1/3W) ±200ppm/C Pad SMD Automotive T/R; Manufacturer Part Number: ERJT08J102V; Manufacturer: Panasonic; Voltage Rating: 200V; Temperature Coefficient: 200ppm/°C; .Creator: GP; Max Power Dissipation: 333mW; Power Rating: 330mW; Min Operating Temperature: -55°C; Radiation Hardening: No; Packaging: Tape and Reel; Tolerance: 5%; RoHS Compliant: Yes; Height: 0.6mm; Resistor Type: Thick Film; Features: Automotive AEC-Q200; Pricing 1: 5=0,32200, 50=0,30000, 100=0,28100, 250=0,25900, 500=0,23800 (USD); REACH SVHC: No SVHC; Width: 0.063inch; Source: Passives.SchLib; Case Code (Metric): 3216; Termination: Tab; Mount: Surface Mount; ComponentLink1URL: https://docs.rs-online.com/ef78/0900766b812cb812.pdf; ComponentLink1Description: Datasheet; Max Operating Temperature: 155°C; Contact Plating: Tin; Package Quantity: 5000; ComponentLink2URL: https://es.rs-online.com/web/p/resistencias-de-montaje-en-superficie/7218936; Military Standard: Not; RoHS: Yes; Category: Resistor; Stock 1: 1; Voltage Rating (DC): 200V; Value: 1k; Design Item ID: R1k-1206FTK; Depth: 1.6mm; Number of Terminations: 2; Case/Package: 1206; ComponentLink2Description: Where buy it; Pins: 2; Length: 3.2mm
SW201 SW202 = CMP-00028-00009-1: Keypad Switch, 1 Switches, SPST, Momentary-tactile, 0.05A, 12VDC, 2.94N, Solder Terminal, Surface Mount-straight; RoHS Compliant: Yes
U201 = AT89C5131A-RDTUM-1: Microcontroller, 8-Bit, FLASH, 8051 CPU, 48MHz, CMOS, PQFP64; Nominal Supply Voltage: 3.3V; Interface: SPI,USB,UART; Min Supply Voltage: 2.7V; Max Supply Voltage: 5.5V; Min Operating Temperature: -40°C; Max Operating Temperature: 85°C; Case/Package: LFQFP; Pins: 64; RoHS Compliant: Yes; Clock Frequency: 48MHz
XTAL201 = CMP-00109-1: 830028710, 20 MHz; Manufacturer: Würth Elektronik; Frequency: 20MHz; Drive level: 500µW max; .Creator: GP; Frequency Stability: +-50 ppm; Max power dissipation: *; Number of pins: 2; Min Operating Temperature: -40ºC; Packaging: Reel; Manufacturer Part Number: 830028710; Max operating temperature.: 85ºC; RoHS: Yes; Source: Passives.SchLib; Stock 1: 975; ComponentLink1Description: Datasheet; Pricing 1: 1=0,37000, 10=0,28100, 50=0,26800, 100=0,24400, 500=0,22000 (USD); Type: SMD; Category: XTAL; ComponentLink1URL: https://www.we-online.com/catalog/datasheet/830028710.pdf; Design Item ID: XTAL20M_SMD; Package: *; Power Rating: *

## Sheet [3] ADC.SchDoc
size A4; DocumentNumber: 4; SheetNumber: 4; SheetTotal: 4
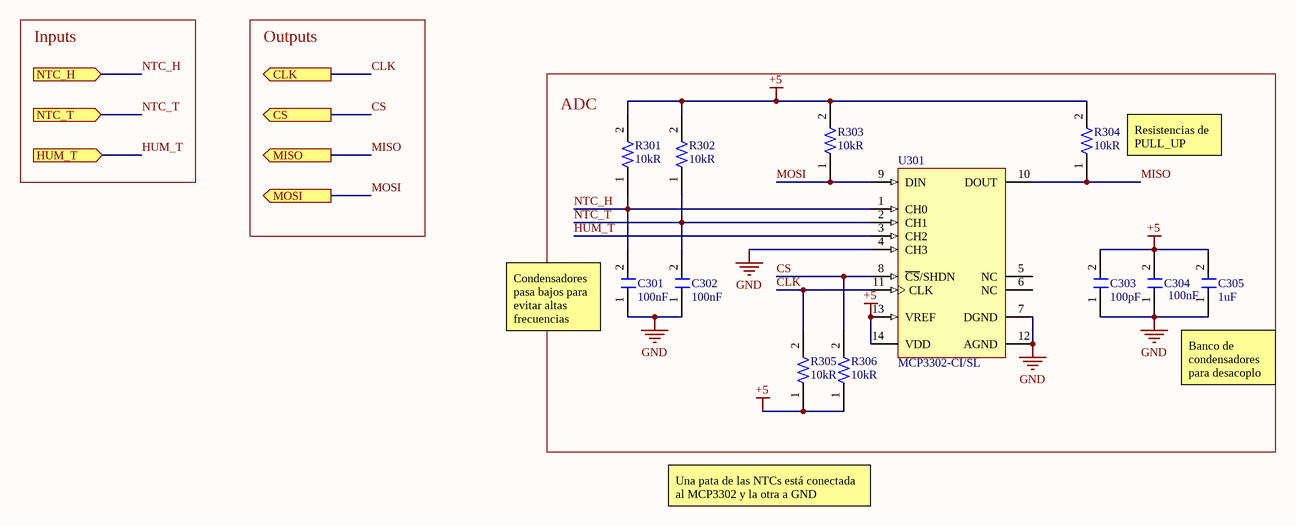
[diagram p3: [3] ADC.SchDoc]

### Parts
C301  Capacitance: 100nF  [C1206FNPC-RW]  (hidden comment: 885012208058)
C302  Capacitance: 100nF  [C1206FNPC-RW]  (hidden comment: 885012208058)
C303  Capacitance: 100pF  [C0805FNPC-W]  (hidden comment: 885012007057)
C304  Capacitance: 100nF  [C1206FNPC-RW]  (hidden comment: 885012208058)
C305  Capacitance: 1uF  [C1206FNPC-RW]  (hidden comment: 885012208036)
R301  Resistance: 10kR  [R1206FTK-W]  (hidden comment: CRCW120610K0FKEA)
R302  Resistance: 10kR  [R1206FTK-W]  (hidden comment: CRCW120610K0FKEA)
R303  Resistance: 10kR  [R1206FTK-W]  (hidden comment: CRCW120610K0FKEA)
R304  Resistance: 10kR  [R1206FTK-W]  (hidden comment: CRCW120610K0FKEA)
R305  Resistance: 10kR  [R1206FTK-W]  (hidden comment: CRCW120610K0FKEA)
R306  Resistance: 10kR  [R1206FTK-W]  (hidden comment: CRCW120610K0FKEA)
U301  MCP3302-CI/SL  [SOIC-SL14_L]

### Blocks framed on the sheet
ADC: C301-C305 R301-R306 U301

### Ports
CLK (out, see AD_info[3B]), CS (out, see AD_info[3B]), HUM_T (in, see AD_info[3B]), MISO (out, see AD_info[3B]), MOSI (out, see AD_info[3B]), NTC_H (in, see AD_info[3B]), NTC_T (in, see AD_info[3B])

### Nets
+5: C303.2 C304.2 C305.2 R301.2 R302.2 R303.2 R304.2 R305.1 R306.1 U301.13(VREF) U301.14(VDD)  [project net +5V]
GND: C301.1 C302.1 C303.1 C304.1 C305.1 U301.4(CH3) U301.7(DGND) U301.12(AGND)
CLK: R305.2 U301.11(CLK) ; port CLK
CS: R306.2 U301.8(~{CS}/SHDN) ; port CS
HUM_T: U301.3(CH2) ; port HUM_T
MISO: R304.1 U301.10(DOUT) ; port MISO
MOSI: R303.1 U301.9(DIN) ; port MOSI
NTC_H: C301.2 R301.1 U301.1(CH0) ; port NTC_H
NTC_T: C302.2 R302.1 U301.2(CH1) ; port NTC_T

Not connected (* = marked no-connect by the designer): U301 5(NC) 6(NC)

### Notes on the sheet
- Inputs
- Outputs
- (near R304) Resistencias de PULL_UP
- (near C301) Condensadores pasa bajos para evitar altas frecuencias
- Banco de condensadores para desacoplo
- Una pata de las NTCs está conectada al MCP3302 y la otra a GND

### Library data of the parts
C301 C302 C304 = C100n-25V-1206FNPC-X7R: as C102 on sheet [1] Supply; Category: Capacitor; ComponentLink1Description: Datasheet; ComponentLink1URL: https://www.we-online.com/catalog/datasheet/885012208058.pdf; ComponentLink2Description: Where buy it; ComponentLink2URL: https://www.we-online.com/catalog/en/WCAP-CSGP-25VDC#885012208058; Supplier 1: Digi-Key; Manufacturer Part Number: 885012208058; RoHS: Yes; Stock 1: 4375; Pricing 1: 1=0,11000, 10=0,10100, 100=0,09100, 500=0,08000 (USD); Mount: Surface Mount; Case/Package: 1206; Case Code (Metric): 3216; Case Code (Imperial): 1206; Min Operating Temperature: -55°C; Max Operating Temperature: 125°C; Packaging: Tape and Reel; Voltage Rating: 25V; Length: 0.126inch; Width: 0.063inch; Thickness: 0.035inch; RoHS Compliant: Yes; ComponentLink3URL: https://katalog.we-online.de/pbs/datasheet/885012208058.pdf?src-supplier=Digi-Key; ComponentLink3Description: https://katalog.we-online.de/pbs/datasheet/885012208058.pdf?src-supplier=Digi-Key; Supplier Part Number 1: 732-8109-1-ND
C303 = C100p-50V-0805FNPC-C0G/NP0: Multilayer Ceramic Capacitor, Wcap-Csgp Series, 100 Pf, 5%, C0G / Np0, 50 V, 0805 [2012 Metric] Rohs Compliant: Yes; Manufacturer: Wurth Electronics; Voltage Rating: 50V; .Creator: DR; Supplier 1: RSComponents; Manufacturer Part Number: 885012007057; RoHS: Yes; Category: Ceramic Capacitors; Stock 1: 1; Pricing 1: 4000=0,03900, 12000=0,03800 (USD); Mount: Surface Mount; Case/Package: 0805; Case Code (Metric): 2012; Case Code (Imperial): 0805; Min Operating Temperature: -55°C; Max Operating Temperature: 125°C; Packaging: Cut Tape; Dielectric: C0G; Tolerance: 5%; Voltage Rating (DC): 50V; Length: 0.079inch; Width: 0.049inch; Thickness: 0.035inch; REACH SVHC: Unknown; RoHS Compliant: Yes; ComponentLink1URL: http://www.farnell.com/datasheets/1958443.pdf?src-supplier=Farnell; ComponentLink1Description: http://www.farnell.com/datasheets/1958443.pdf?src-supplier=Farnell; ComponentLink2URL: https://katalog.we-online.de/pbs/datasheet/885012007057.pdf?src-supplier=Digi-Key; ComponentLink2Description: https://katalog.we-online.de/pbs/datasheet/885012007057.pdf?src-supplier=Digi-Key; ComponentLink3URL: http://www.farnell.com/datasheets/1958443.pdf?src-supplier=Element14; ComponentLink3Description: http://www.farnell.com/datasheets/1958443.pdf?src-supplier=Element14; ComponentLink4URL: http://www.farnell.com/datasheets/1958443.pdf?src-supplier=Newark; ComponentLink4Description: http://www.farnell.com/datasheets/1958443.pdf?src-supplier=Newark; ComponentLink5Description: Where buy it; ComponentLink5URL: https://www.we-online.com/catalog/en/WCAP-CSGP-50VDC#885012007057; Supplier Part Number 1: 1813930
C305 = C1u-16V-1206FNPC-X7R: Cap Cer 1UF 16V X7R 1206; Manufacturer: Wurth Electronics; Tolerance: 10%; .Creator: GP; Category: Capacitor; ComponentLink1Description: Datasheet; ComponentLink1URL: https://www.we-online.com/catalog/datasheet/885012208036.pdf; ComponentLink2Description: Where buy it; ComponentLink2URL: https://www.we-online.com/catalog/en/WCAP-CSGP-16VDC#885012208036; Supplier 1: Mouser; Manufacturer Part Number: 885012208036; RoHS: Yes; Stock 1: 5938; Pricing 1: 1=0,15000, 10=0,13900, 50=0,13900, 100=0,12400, 500=0,11000, 1000=0,11000, 3000=0,09100, 10000=0,09100 (USD); Mount: Surface Mount; Case/Package: 1206; Case Code (Metric): 3216; Case Code (Imperial): 1206; Min Operating Temperature: -55°C; Max Operating Temperature: 125°C; Packaging: Tape and Reel; Voltage Rating: 16V; Length: 0.126inch; Width: 0.063inch; Thickness: 0.051inch; RoHS Compliant: Yes; Supplier Part Number 1: 710-885012208036
R301-R306 = R10k-1206FTK: Res Thick Film 1206 10K Ohm 1% 0.25W(1/4W) +/-100ppm/ßC Pad SMD Automotive T/R; Temperature Coefficient: 100ppm/°C; Voltage Rating: 200V; .Creator: GP; Category: Resistor; ComponentLink1Description: Datasheet; ComponentLink1URL: https://docs.rs-online.com/bca8/A700000006404581.pdf; ComponentLink2Description: Where buy it; ComponentLink2URL: https://es.rs-online.com/web/p/resistencias-de-montaje-en-superficie/6791765; Supplier 1: Allied Electronics; Case/Package: 1206; Number of Pins: 2; Contact Plating: Tin; Weight: 0.000353oz; Case Code (Metric): 3216; Case Code (Imperial): 1206; Package Shape: Rectangular; Size Code: 1206; Terminal Finish: Tin; Resistor Type: Thick Film; Package Quantity: 10; Number of Terminations: 2; Termination: SMD/SMT; Voltage Rating (DC): 200V; Features: Automotive AEC-Q200; Series: CRCW; Construction: Rectangular; Resistance Tolerance: 1%; Working Voltage: 200V; Length: 3.2mm; Width: 0.063inch; Height: 0.55mm; Depth: 1.6mm; Radiation Hardening: No; Lead Free: Lead Free; RoHS Compliant: Yes; REACH SVHC: Unknown; Military Standard: Not; Supplier Part Number 1: 70201262
U301 = CMP-031-00009-1: ADC, Successive Approximation, 13-Bit, 1 Func, 4 Channel, Serial Access, PDSO14; RoHS Compliant: Yes; Case/Package: SOP; Max Operating Temperature: 85°C; Min Operating Temperature: -40°C; Pins: 14